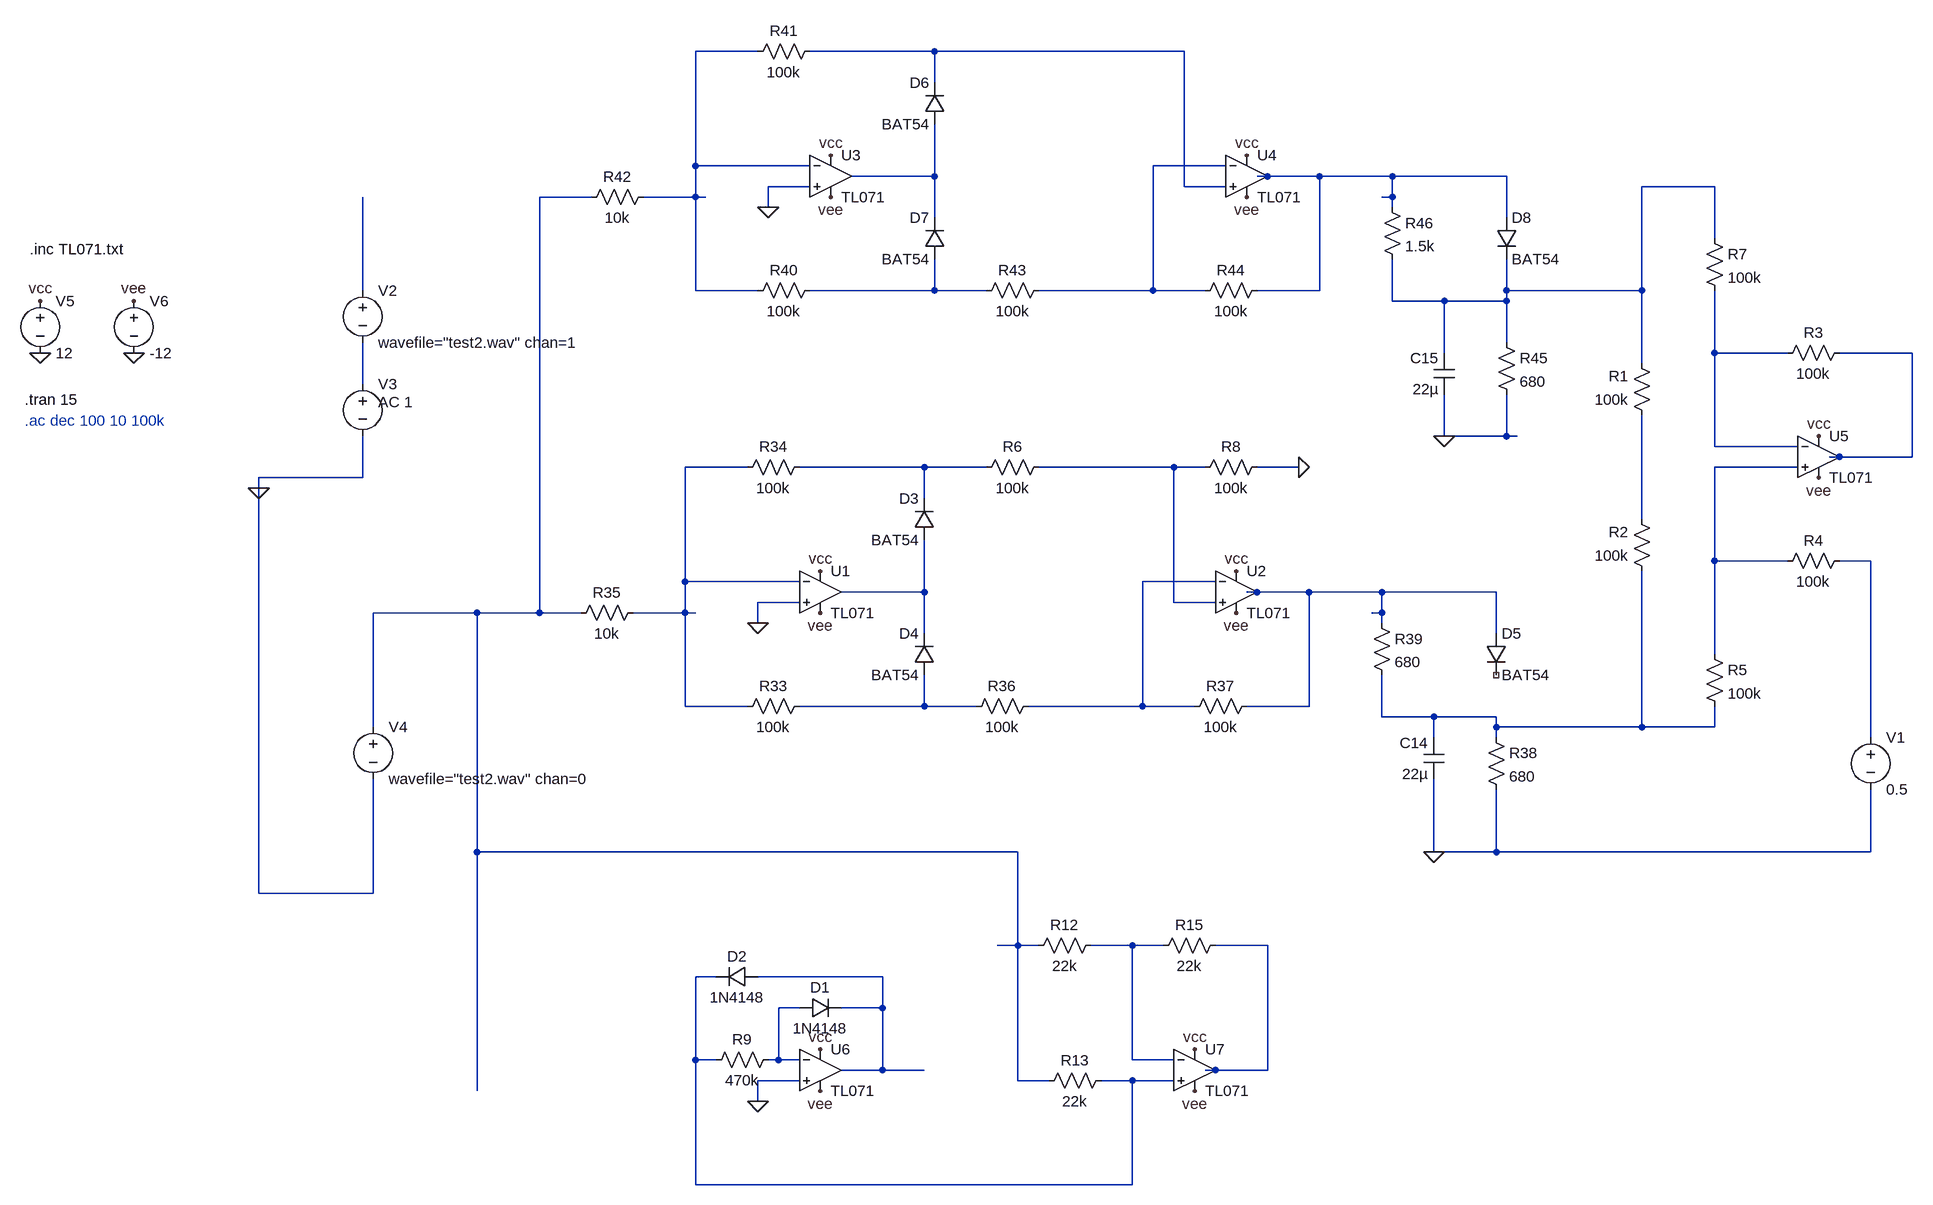
[diagram p0: schematic vumeter2.asc]
vumeter2.asc, the LTspice schematic file:
Version 4.1
SHEET 1 4276 2852
WIRE 576 -32 480 -32
WIRE 848 -32 656 -32
WIRE 1232 -32 848 -32
WIRE 848 16 848 -32
WIRE 480 144 480 -32
WIRE 656 144 480 144
WIRE 1296 144 1184 144
WIRE 848 160 848 80
WIRE 848 160 720 160
WIRE 1360 160 1344 160
WIRE 1440 160 1360 160
WIRE 1552 160 1440 160
WIRE 1728 160 1552 160
WIRE 656 176 592 176
WIRE 1232 176 1232 -32
WIRE 1296 176 1232 176
WIRE 2048 176 1936 176
WIRE 320 192 240 192
WIRE 480 192 480 144
WIRE 480 192 400 192
WIRE 496 192 480 192
WIRE 1552 192 1552 160
WIRE 1552 192 1536 192
WIRE 592 208 592 176
WIRE 1552 208 1552 192
WIRE 848 224 848 160
WIRE 1728 224 1728 160
WIRE 2048 256 2048 176
WIRE -32 336 -32 192
WIRE 480 336 480 192
WIRE 576 336 480 336
WIRE 848 336 848 288
WIRE 848 336 656 336
WIRE 928 336 848 336
WIRE 1184 336 1184 144
WIRE 1184 336 1008 336
WIRE 1264 336 1184 336
WIRE 1440 336 1440 160
WIRE 1440 336 1344 336
WIRE 1728 336 1728 288
WIRE 1936 336 1936 176
WIRE 1936 336 1728 336
WIRE 1552 352 1552 288
WIRE 1632 352 1552 352
WIRE 1728 352 1728 336
WIRE 1728 352 1632 352
WIRE 1728 416 1728 352
WIRE 1632 432 1632 352
WIRE 2048 432 2048 336
WIRE 2160 432 2048 432
WIRE 2352 432 2240 432
WIRE 1936 448 1936 336
WIRE -32 480 -32 416
WIRE 1632 560 1632 496
WIRE 1728 560 1728 496
WIRE 1728 560 1632 560
WIRE 1744 560 1728 560
WIRE 2048 576 2048 432
WIRE 2176 576 2048 576
WIRE 2240 592 2224 592
WIRE 2352 592 2352 432
WIRE 2352 592 2240 592
WIRE 560 608 464 608
WIRE 832 608 640 608
WIRE 928 608 832 608
WIRE 1216 608 1008 608
WIRE 1264 608 1216 608
WIRE 1408 608 1344 608
WIRE 2176 608 2048 608
WIRE -32 624 -32 560
WIRE -32 624 -192 624
WIRE -192 640 -192 624
WIRE 832 656 832 608
WIRE 1936 688 1936 528
WIRE 2048 752 2048 608
WIRE 2160 752 2048 752
WIRE 2288 752 2240 752
WIRE 464 784 464 608
WIRE 640 784 464 784
WIRE 1280 784 1168 784
WIRE 832 800 832 720
WIRE 832 800 704 800
WIRE 1344 800 1328 800
WIRE 1424 800 1344 800
WIRE 1536 800 1424 800
WIRE 1712 800 1536 800
WIRE 640 816 576 816
WIRE 1216 816 1216 608
WIRE 1280 816 1216 816
WIRE 144 832 -16 832
WIRE 240 832 240 192
WIRE 240 832 144 832
WIRE 304 832 240 832
WIRE 464 832 464 784
WIRE 464 832 384 832
WIRE 480 832 464 832
WIRE 1536 832 1536 800
WIRE 1536 832 1520 832
WIRE 576 848 576 816
WIRE 1536 848 1536 832
WIRE 832 864 832 800
WIRE 1712 864 1712 800
WIRE 2048 896 2048 752
WIRE 464 976 464 832
WIRE 560 976 464 976
WIRE 832 976 832 928
WIRE 832 976 640 976
WIRE 912 976 832 976
WIRE 1168 976 1168 784
WIRE 1168 976 992 976
WIRE 1248 976 1168 976
WIRE 1424 976 1424 800
WIRE 1424 976 1328 976
WIRE 1536 992 1536 928
WIRE 1616 992 1536 992
WIRE 1712 992 1616 992
WIRE -16 1008 -16 832
WIRE 1712 1008 1712 992
WIRE 1936 1008 1936 768
WIRE 1936 1008 1712 1008
WIRE 2048 1008 2048 976
WIRE 2048 1008 1936 1008
WIRE 1616 1024 1616 992
WIRE 1712 1024 1712 1008
WIRE 2288 1024 2288 752
WIRE 144 1200 144 832
WIRE 976 1200 144 1200
WIRE 1616 1200 1616 1088
WIRE 1712 1200 1712 1104
WIRE 1712 1200 1616 1200
WIRE 2288 1200 2288 1104
WIRE 2288 1200 1712 1200
WIRE -192 1264 -192 640
WIRE -16 1264 -16 1088
WIRE -16 1264 -192 1264
WIRE 976 1344 976 1200
WIRE 976 1344 944 1344
WIRE 1008 1344 976 1344
WIRE 1152 1344 1088 1344
WIRE 1200 1344 1152 1344
WIRE 1360 1344 1280 1344
WIRE 512 1392 480 1392
WIRE 768 1392 576 1392
WIRE 640 1440 608 1440
WIRE 768 1440 768 1392
WIRE 768 1440 704 1440
WIRE 480 1520 480 1392
WIRE 512 1520 480 1520
WIRE 608 1520 608 1440
WIRE 608 1520 592 1520
WIRE 640 1520 608 1520
WIRE 1152 1520 1152 1344
WIRE 1216 1520 1152 1520
WIRE 768 1536 768 1440
WIRE 768 1536 704 1536
WIRE 832 1536 768 1536
WIRE 1280 1536 1264 1536
WIRE 1360 1536 1360 1344
WIRE 1360 1536 1280 1536
WIRE 640 1552 576 1552
WIRE 976 1552 976 1344
WIRE 1024 1552 976 1552
WIRE 1152 1552 1104 1552
WIRE 1216 1552 1152 1552
WIRE 144 1568 144 1200
WIRE 576 1584 576 1552
WIRE 480 1712 480 1520
WIRE 1152 1712 1152 1552
WIRE 1152 1712 480 1712
FLAG -192 640 0
FLAG -528 352 vcc
FLAG -384 352 vee
FLAG -528 432 0
FLAG -384 432 0
FLAG 672 768 vcc
FLAG 672 832 vee
FLAG 576 848 0
FLAG 1312 768 vcc
FLAG 1312 832 vee
FLAG 1616 1200 0
FLAG 688 128 vcc
FLAG 688 192 vee
FLAG 592 208 0
FLAG 1328 128 vcc
FLAG 1328 192 vee
FLAG 1632 560 0
FLAG 2208 560 vcc
FLAG 2208 624 vee
FLAG 1408 608 0
FLAG 672 1504 vcc
FLAG 672 1568 vee
FLAG 576 1584 0
FLAG 1248 1504 vcc
FLAG 1248 1568 vee
SYMBOL voltage -32 320 R0
WINDOW 123 0 0 Left 0
WINDOW 39 0 0 Left 0
SYMATTR InstName V2
SYMATTR Value wavefile="test2.wav" chan=1
SYMBOL voltage -32 464 R0
WINDOW 123 24 44 Left 2
WINDOW 39 0 0 Left 0
SYMATTR Value2 AC 1
SYMATTR InstName V3
SYMATTR Value ""
SYMBOL voltage -16 992 R0
WINDOW 123 0 0 Left 0
WINDOW 39 0 0 Left 0
SYMATTR InstName V4
SYMATTR Value wavefile="test2.wav" chan=0
SYMBOL OpAmps\\opamp2 672 736 R0
SYMATTR InstName U1
SYMATTR Value TL071
SYMBOL voltage -528 336 R0
SYMATTR InstName V5
SYMATTR Value 12
SYMBOL voltage -384 336 R0
SYMATTR InstName V6
SYMATTR Value -12
SYMBOL diode 848 720 R180
WINDOW 0 24 64 Left 2
WINDOW 3 24 0 Left 2
SYMATTR InstName D3
SYMATTR Value BAT54
SYMBOL diode 848 928 R180
WINDOW 0 24 64 Left 2
WINDOW 3 24 0 Left 2
SYMATTR InstName D4
SYMATTR Value BAT54
SYMBOL res 656 960 R90
WINDOW 0 0 56 VBottom 2
WINDOW 3 32 56 VTop 2
SYMATTR InstName R33
SYMATTR Value 100k
SYMBOL res 656 592 R90
WINDOW 0 0 56 VBottom 2
WINDOW 3 32 56 VTop 2
SYMATTR InstName R34
SYMATTR Value 100k
SYMBOL res 400 816 R90
WINDOW 0 0 56 VBottom 2
WINDOW 3 32 56 VTop 2
SYMATTR InstName R35
SYMATTR Value 10k
SYMBOL OpAmps\\opamp2 1312 736 R0
SYMATTR InstName U2
SYMATTR Value TL071
SYMBOL res 1008 960 R90
WINDOW 0 0 56 VBottom 2
WINDOW 3 32 56 VTop 2
SYMATTR InstName R36
SYMATTR Value 100k
SYMBOL res 1344 960 R90
WINDOW 0 0 56 VBottom 2
WINDOW 3 32 56 VTop 2
SYMATTR InstName R37
SYMATTR Value 100k
SYMBOL cap 1632 1088 R180
WINDOW 0 24 56 Left 2
WINDOW 3 24 8 Left 2
SYMATTR InstName C14
SYMATTR Value 22µ
SYMBOL res 1696 1008 R0
SYMATTR InstName R38
SYMATTR Value 680
SYMBOL res 1520 832 R0
SYMATTR InstName R39
SYMATTR Value 680
SYMBOL diode 1696 864 R0
SYMATTR InstName D5
SYMATTR Value BAT54
SYMBOL OpAmps\\opamp2 688 96 R0
SYMATTR InstName U3
SYMATTR Value TL071
SYMBOL diode 864 80 R180
WINDOW 0 24 64 Left 2
WINDOW 3 24 0 Left 2
SYMATTR InstName D6
SYMATTR Value BAT54
SYMBOL diode 864 288 R180
WINDOW 0 24 64 Left 2
WINDOW 3 24 0 Left 2
SYMATTR InstName D7
SYMATTR Value BAT54
SYMBOL res 672 320 R90
WINDOW 0 0 56 VBottom 2
WINDOW 3 32 56 VTop 2
SYMATTR InstName R40
SYMATTR Value 100k
SYMBOL res 672 -48 R90
WINDOW 0 0 56 VBottom 2
WINDOW 3 32 56 VTop 2
SYMATTR InstName R41
SYMATTR Value 100k
SYMBOL res 416 176 R90
WINDOW 0 0 56 VBottom 2
WINDOW 3 32 56 VTop 2
SYMATTR InstName R42
SYMATTR Value 10k
SYMBOL OpAmps\\opamp2 1328 96 R0
SYMATTR InstName U4
SYMATTR Value TL071
SYMBOL res 1024 320 R90
WINDOW 0 0 56 VBottom 2
WINDOW 3 32 56 VTop 2
SYMATTR InstName R43
SYMATTR Value 100k
SYMBOL res 1360 320 R90
WINDOW 0 0 56 VBottom 2
WINDOW 3 32 56 VTop 2
SYMATTR InstName R44
SYMATTR Value 100k
SYMBOL cap 1648 496 R180
WINDOW 0 24 56 Left 2
WINDOW 3 24 8 Left 2
SYMATTR InstName C15
SYMATTR Value 22µ
SYMBOL res 1712 400 R0
SYMATTR InstName R45
SYMATTR Value 680
SYMBOL res 1536 192 R0
SYMATTR InstName R46
SYMATTR Value 1.5k
SYMBOL diode 1712 224 R0
SYMATTR InstName D8
SYMATTR Value BAT54
SYMBOL OpAmps\\opamp2 2208 528 R0
SYMATTR InstName U5
SYMATTR Value TL071
SYMBOL res 1952 544 R180
WINDOW 0 36 76 Left 2
WINDOW 3 36 40 Left 2
SYMATTR InstName R1
SYMATTR Value 100k
SYMBOL res 1952 784 R180
WINDOW 0 36 76 Left 2
WINDOW 3 36 40 Left 2
SYMATTR InstName R2
SYMATTR Value 100k
SYMBOL res 2144 448 R270
WINDOW 0 32 56 VTop 2
WINDOW 3 0 56 VBottom 2
SYMATTR InstName R3
SYMATTR Value 100k
SYMBOL res 2144 768 R270
WINDOW 0 32 56 VTop 2
WINDOW 3 0 56 VBottom 2
SYMATTR InstName R4
SYMATTR Value 100k
SYMBOL res 2032 880 R0
SYMATTR InstName R5
SYMATTR Value 100k
SYMBOL res 2032 240 R0
SYMATTR InstName R7
SYMATTR Value 100k
SYMBOL voltage 2288 1008 R0
WINDOW 123 0 0 Left 0
WINDOW 39 0 0 Left 0
SYMATTR InstName V1
SYMATTR Value 0.5
SYMBOL res 1024 592 R90
WINDOW 0 0 56 VBottom 2
WINDOW 3 32 56 VTop 2
SYMATTR InstName R6
SYMATTR Value 100k
SYMBOL res 1360 592 R90
WINDOW 0 0 56 VBottom 2
WINDOW 3 32 56 VTop 2
SYMATTR InstName R8
SYMATTR Value 100k
SYMBOL OpAmps\\opamp2 672 1472 R0
SYMATTR InstName U6
SYMATTR Value TL071
SYMBOL OpAmps\\opamp2 1248 1472 R0
SYMATTR InstName U7
SYMATTR Value TL071
SYMBOL res 1296 1328 R90
WINDOW 0 0 56 VBottom 2
WINDOW 3 32 56 VTop 2
SYMATTR InstName R15
SYMATTR Value 22k
SYMBOL diode 576 1376 R90
WINDOW 0 0 32 VBottom 2
WINDOW 3 32 32 VTop 2
SYMATTR InstName D2
SYMATTR Value 1N4148
SYMBOL res 1104 1328 R90
WINDOW 0 0 56 VBottom 2
WINDOW 3 32 56 VTop 2
SYMATTR InstName R12
SYMATTR Value 22k
SYMBOL res 1120 1536 R90
WINDOW 0 0 56 VBottom 2
WINDOW 3 32 56 VTop 2
SYMATTR InstName R13
SYMATTR Value 22k
SYMBOL res 608 1504 R90
WINDOW 0 0 56 VBottom 2
WINDOW 3 32 56 VTop 2
SYMATTR InstName R9
SYMATTR Value 470k
SYMBOL diode 640 1456 R270
WINDOW 0 32 32 VTop 2
WINDOW 3 0 32 VBottom 2
SYMATTR InstName D1
SYMATTR Value 1N4148
TEXT -552 504 Left 2 !.tran 15
TEXT -552 536 Left 2 ;.ac dec 100 10 100k
TEXT -544 272 Left 2 !.inc TL071.txt

The netlist it stands for:
* vumeter2.asc
V2 N008 N012 wavefile="test2.wav" chan=1
V3 N012 0 AC 1
V4 N007 0 wavefile="test2.wav" chan=0
X§U1 0 N013 vcc vee N020 TL071  ; pins In+ In- V+ V- OUT
V5 vcc 0 12
V6 vee 0 -12
D3 N020 N014 BAT54
D4 N022 N020 BAT54
R33 N022 N013 100k
R34 N014 N013 100k
R35 N013 N007 10k
X§U2 N015 N019 vcc vee N021 TL071  ; pins In+ In- V+ V- OUT
R36 N019 N022 100k
R37 N021 N019 100k
C14 0 N023 22µ
R38 N023 0 680
R39 N021 N023 680
D5 N021 NC_01 BAT54
X§U3 0 N001 vcc vee N004 TL071  ; pins In+ In- V+ V- OUT
D6 N004 N002 BAT54
D7 N009 N004 BAT54
R40 N009 N001 100k
R41 N002 N001 100k
R42 N001 N007 10k
X§U4 N002 N003 vcc vee N005 TL071  ; pins In+ In- V+ V- OUT
R43 N003 N009 100k
R44 N005 N003 100k
C15 0 N006 22µ
R45 N006 0 680
R46 N005 N006 1.5k
D8 N005 N006 BAT54
X§U5 N016 N010 vcc vee N011 TL071  ; pins In+ In- V+ V- OUT
R1 N017 N006 100k
R2 N023 N017 100k
R3 N010 N011 100k
R4 N016 N018 100k
R5 N016 N023 100k
R7 N006 N010 100k
V1 N018 0 0.5
R6 N015 N014 100k
R8 0 N015 100k
X§U6 0 N028 vcc vee N027 TL071  ; pins In+ In- V+ V- OUT
X§U7 N026 N024 vcc vee N025 TL071  ; pins In+ In- V+ V- OUT
R15 N025 N024 22k
D2 N027 N026 1N4148
R12 N024 N007 22k
R13 N026 N007 22k
R9 N028 N026 470k
D1 N028 N027 1N4148
.model D D
.lib standard.dio
.tran 15
* .ac dec 100 10 100k
.inc TL071.txt
.backanno
.end